# Altium schematic sheet CPU.SchDoc
size A
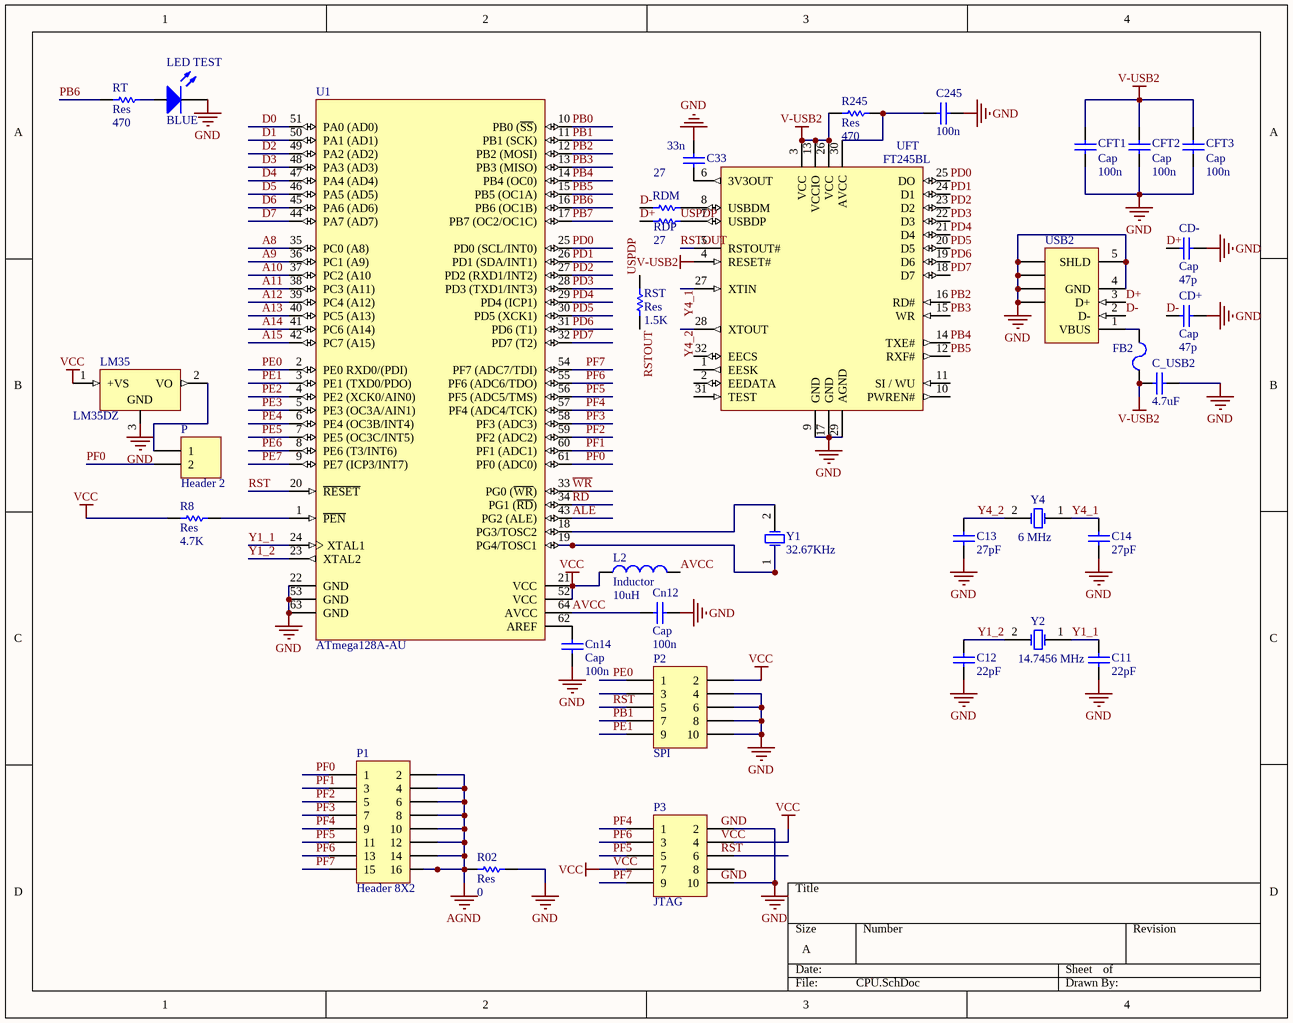
[diagram p0: CPU.SchDoc]

## Parts
C11  value 22pF  [1608[0603]]  (hidden comment: Cap_UP)
C12  value 22pF  [1608[0603]]  (hidden comment: Cap_UP)
C13  value 27pF  [1608[0603]]  (hidden comment: Cap_UP)
C14  value 27pF  [1608[0603]]  (hidden comment: Cap_UP)
C33  value 33n  [1608[0603]]  (hidden comment: Cap_UP)
C245  value 100n  [1608[0603]]  (hidden comment: Cap_UP)
C_USB2  value 4.7uF  [2012[0805]]  (hidden comment: Cap_UP)
CD+  Cap  value 47p  [1608[0603]]
CD-  Cap  value 47p  [1608[0603]]
CFT1  Cap  value 100n  [1608[0603]]
CFT2  Cap  value 100n  [1608[0603]]
CFT3  Cap  value 100n  [1608[0603]]
Cn12  Cap  value 100n  [1608[0603]]
Cn14  Cap  value 100n  [1608[0603]]
FB2  (no value)  [2012[0805]]
L2  Inductor  value 10uH  [2012[0805]]
LED_TEST  BLUE  [3518]
LM35  LM35DZ  [Z03A]
P  Header 2  [HDR1X2]
P1  Header 8X2  [HDR2X8]
P2  SPI  [HDR2X5]
P3  JTAG  [HDR2X5]
R02  Res  value 0  [1608[0603]]
R8  Res  value 4.7K  [1608[0603]]
R245  Res  value 470  [1608[0603]]
RDM  value 27  [1608[0603]]  (hidden comment: Res)
RDP  value 27  [1608[0603]]  (hidden comment: es)
RST  Res  value 1.5K  [1608[0603]]
RT  Res  value 470  [1608[0603]]
U1  ATmega128A-AU  [64A_N]
UFT  FT245BL  [LQFP-32_N]
USB2  (no value)  [USB_Mini]
Y1  32.67KHz  [Xtal-smd]
Y2  14.7456 MHz  [Xtal-smd]
Y4  6 MHz  [Xtal-smd]

## Nets
AGND: P1.2 P1.4 P1.6 P1.8 P1.10 P1.12 P1.14 P1.16 R02.2
GND: C11.2 C12.2 C13.2 C14.2 C33.2 C245.2 C_USB2.2 CD+.1 CD-.1 CFT1.1 CFT2.1 CFT3.1 Cn12.1 Cn14.2 LED_TEST.2(K) P2.4 P2.6 P2.8 P2.10 P3.2 P3.10 R02.1 U1.22(GND) U1.53(GND) U1.63(GND) UFT.9(GND) UFT.17(GND) UFT.29(AGND) USB2.4(GND) USB2.5(SHLD) USB2.6(SHLD) USB2.7(SHLD) USB2.8(SHLD) USB2.9(SHLD)
V-USB2: C_USB2.1 CFT1.2 CFT2.2 CFT3.2 FB2.2 R245.1 UFT.3(VCC) UFT.4(RESET#) UFT.13(VCCIO) UFT.26(VCC)
VCC: L2.1 LM35.1(+VS) P2.2 P3.4 P3.7 R8.1 U1.21(VCC) U1.52(VCC)
A8: U1.35(PC0_(A8))
A9: U1.36(PC1_(A9))
A10: U1.37(PC2_(A10)
A11: U1.38(PC3_(A11))
A12: U1.39(PC4_(A12))
A13: U1.40(PC5_(A13))
A14: U1.41(PC6_(A14))
A15: U1.42(PC7_(A15))
ALE: U1.43(PG2_(ALE))
AVCC: Cn12.2 L2.2 U1.64(AVCC)
D0: U1.51(PA0_(AD0))
D1: U1.50(PA1_(AD1))
D2: U1.49(PA2_(AD2))
D3: U1.48(PA3_(AD3))
D4: U1.47(PA4_(AD4))
D5: U1.46(PA5_(AD5))
D6: U1.45(PA6_(AD6))
D7: U1.44(PA7_(AD7))
D+: CD-.2 RDP.1 USB2.3(D+)
D-: CD+.2 RDM.1 USB2.2(D-)
PB0: U1.10(PB0_(~{SS}))
PB1: P2.7 U1.11(PB1_(SCK))
PB2: U1.12(PB2_(MOSI)) UFT.16(RD#)
PB3: U1.13(PB3_(MISO)) UFT.15(WR)
PB4: U1.14(PB4_(OC0)) UFT.14(TXE#)
PB5: U1.15(PB5_(OC1A)) UFT.12(RXF#)
PB6: RT.2 U1.16(PB6_(OC1B))
PB7: U1.17(PB7_(OC2/OC1C))
PD0: U1.25(PD0_(SCL/INT0)) UFT.25(DO)
PD1: U1.26(PD1_(SDA/INT1)) UFT.24(D1)
PD2: U1.27(PD2_(RXD1/INT2)) UFT.23(D2)
PD3: U1.28(PD3_(TXD1/INT3)) UFT.22(D3)
PD4: U1.29(PD4_(ICP1)) UFT.21(D4)
PD5: U1.30(PD5_(XCK1)) UFT.20(D5)
PD6: U1.31(PD6_(T1)) UFT.19(D6)
PD7: U1.32(PD7_(T2)) UFT.18(D7)
PE0: P2.1 U1.2(PE0_RXD0/(PDI))
PE1: P2.9 U1.3(PE1_(TXD0/PDO))
PE2: U1.4(PE2_(XCK0/AIN0))
PE3: U1.5(PE3_(OC3A/AIN1))
PE4: U1.6(PE4_(OC3B/INT4))
PE5: U1.7(PE5_(OC3C/INT5))
PE6: U1.8(PE6_(T3/INT6))
PE7: U1.9(PE7_(ICP3/INT7))
PF0: P.2 P1.1 U1.61(PF0_(ADC0))
PF1: P1.3 U1.60(PF1_(ADC1))
PF2: P1.5 U1.59(PF2_(ADC2))
PF3: P1.7 U1.58(PF3_(ADC3))
PF4: P1.9 P3.1 U1.57(PF4_(ADC4/TCK))
PF5: P1.11 P3.5 U1.56(PF5_(ADC5/TMS))
PF6: P1.13 P3.3 U1.55(PF6_(ADC6/TDO))
PF7: P1.15 P3.9 U1.54(PF7_(ADC7/TDI))
~{RD}: U1.34(PG1_(~{RD}))
RST: P2.5 U1.20(~{RESET})
RSTOUT: RST.1 UFT.5(RSTOUT#)
USPDP: RST.2
~{WR}: U1.33(PG0_(~{WR}))
Y1_1: C11.1 U1.24(XTAL1) Y2.1(OSC1)
Y1_2: C12.1 U1.23(XTAL2) Y2.2(OSC2)
Y4_1: C14.1 UFT.27(XTIN) Y4.1(OSC1)
Y4_2: C13.1 UFT.28(XTOUT) Y4.2(OSC2)
NetC33_1: C33.1 UFT.6(3V3OUT)
NetC245_1: C245.1 R245.2 UFT.30(AVCC)
NetCn14_1: Cn14.1 U1.62(AREF)
NetFB2_1: FB2.1 USB2.1(VBUS)
NetLED_TEST_1: LED_TEST.1(A) RT.1
NetLM35_2: LM35.2(VO) P.1
NetR8_2: R8.2 U1.1(~{PEN})
NetRDM_2: RDM.2 UFT.8(USBDM)
NetRDP_2: RDP.2 UFT.7(USBDP)
NetU1_18: U1.18(PG3/TOSC2) Y1.2(OSC2)
NetU1_19: U1.19(PG4/TOSC1) Y1.1(OSC1)

Not connected (* = marked no-connect by the designer): LM35 3(GND); P2 3; P3 6 8; UFT 1(EESK) 2(EEDATA) 10(PWREN#) 11(SI_/_WU) 31(TEST) 32(EECS)

## Notes on the sheet
- Labels drawn without touching a wire or pin: GND, RST, USPDP, VCC

## Library data of the parts
C11-C14 C33 C245 C_USB2 = Cap_UP: Capacitor; Published: 8-Jun-2000; LatestRevisionDate: 17-Jul-2002; LatestRevisionNote: Re-released for DXP Platform.; PackageReference: RAD-0.3; Publisher: Altium Limited
CD+ CD- CFT1-CFT3 Cn12 Cn14 = Cap: Capacitor; Published: 8-Jun-2000; LatestRevisionDate: 17-Jul-2002; LatestRevisionNote: Re-released for DXP Platform.; PackageReference: RAD-0.3; Publisher: Altium Limited; PackageDescription: Radial Cap, Thru-Hole; 2 Leads; 0.3 in Pin Spacing
FB2 = Ferrite Beed: Code_IEC: 1005; Published: 8-Jun-2000; LatestRevisionDate: 17-Jul-2002; LatestRevisionNote: Re-released for DXP Platform.; PackageReference: 0402-A; Publisher: Altium Limited; Code_JEITA: 0402
L2 = Inductor: Code_IEC: 1005; Published: 8-Jun-2000; LatestRevisionDate: 29-May-2009; LatestRevisionNote: IPC-7351 Footprint Added.; PackageReference: 0402-A; Publisher: Altium Limited; PackageDescription: Chip Inductor; Code_JEITA: 0402
LED_TEST = LED3: Typical BLUE SiC LED; Published: 8-Jun-2000; LatestRevisionDate: 17-Dec-2003; LatestRevisionNote: PCB Footprint replaced.; DatasheetVersion: 16-Apr-2002; PackageVersion: 16-Apr-2002; PackageReference: 3.5X2.8X1.9; Publisher: Altium Limited; PackageDescription: SM LED; 2 C-Bend Leads; Body 3.5 x 2.8 x 1.9 mm, inc leads (LxWxH typ)
LM35 = LM35DZ: Precision Centigrade Temperature Sensor, 3-pin TO-92; Manufacturer: National Semiconductor; PackageTopMarking: NSXYTT*LM35*DZ; PowerWise: N; CompType: Temp Sensor IC; High-Reliability: Y; DatasheetVersion: Nov-2000; PackageVersion: revG, Sep-2000; PackageReference: Z03A; PackageDescription: TO-92, Molded, 3 Lead; PartNumber: LM35DZ; RoHS: N; PinCount: 3; Code_JEDEC: TO-226-AA; ComponentLink1Description: Manufacturer URL; ComponentLink1URL: http://www.national.com/; ComponentLink2Description: LM35 Datasheet; ComponentLink2URL: http://www.national.com/ds/LM/LM35.pdf; ComponentLink3Description: LM35 Web Page; ComponentLink3URL: http://www.national.com/pf/LM/LM35.html; ComponentLink4Description: Z03A Package Page; ComponentLink4URL: http://www.national.com/packaging/folders/z03a.html
P = Header 2: Header, 2-Pin; LatestRevisionDate: 17-Jul-2002; LatestRevisionNote: Re-released for DXP Platform.; Publisher: Altium Limited
P1 = Header 8X2: Header, 8-Pin, Dual row; LatestRevisionDate: 17-Jul-2002; LatestRevisionNote: Re-released for DXP Platform.; Publisher: Altium Limited
P2 P3 = Header 5X2: Header, 5-Pin, Dual row; LatestRevisionDate: 17-Jul-2002; LatestRevisionNote: Re-released for DXP Platform.; Publisher: Altium Limited
R02 R8 R245 RDM RDP RST RT = Res: Semiconductor Resistor; Published: 8-Jun-2000; LatestRevisionDate: 17-Jul-2002; LatestRevisionNote: Re-released for DXP Platform.; PackageReference: AXIAL-0.5; Publisher: Altium Limited
U1 = ATmega128A-AU: 8-bit AVR Microcontroller, 2.7-5.5V, 16MHz, 128KB Flash, 4KB EEPROM, 4KB SRAM, 64-pin TQFP, Industrial Grade (-40°C to 85°C); DatasheetVersion: revH, Feb-2011; PackageVersion: revC, Oct-2010; PackageReference: 64A; PackageDescription: 64-Pin Plastic Thin Profile Quad Flat Pack, 14 x 14 x 1.0 mm Body, 0.8 mm Pitch (TQFP); Code_JEDEC: MS-026-AEB; ComponentLink1Description: Manufacturer URL; ComponentLink1URL: http://www.atmel.com/; ComponentLink2Description: ATmega128A Datasheet; ComponentLink2URL: http://www.atmel.com/dyn/resources/prod_documents/doc8151.pdf; ComponentLink3Description: ATmega128A Summary; ComponentLink3URL: http://www.atmel.com/dyn/resources/prod_documents/8151S.pdf
UFT = FT245BL: USB/Parallel FIFO Bi-Directional Data Transfer Chip, LQFP-32, Pb-Free; Published: 6-Jun-2005; LatestRevisionDate: 13-Apr-2006; LatestRevisionNote: IPC-7351 Footprint Added.; DatasheetVersion: ver 1.7, Dec-2005; PackageVersion: 2004; PackageReference: LQFP-32; Publisher: Altium Limited; PackageDescription: 32-Pin Thin Quad Flat Pack 0.8 mm Pitch; ComponentLink1Description: Manufacturer Link; ComponentLink1URL: http://www.ftdichip.com/Products/ICs/FT245B.htm; ComponentLink2Description: Datasheet; ComponentLink2URL: http://www.ftdichip.com/Support/Documents/DataSheets/ICs/DS_FT245BL.pdf
USB2 = 440479-1: USB 2.0, Right Angle, SMT, AB Type, Receptacle, 5 Position, Black; ContactMaterial: Phosphor Bronze; ContactPlating: Gold (30) over Nickel; PCB_Layout: Complies with manufacturer's recommendation.; DrillSize: Corresponds to nominal value.; PanelGround: Without; Published: 15-Jul-2004; DatasheetDocument: 28-Jan-2003; PackageDocument: 28-Jan-2003; PackageReference: 440479; Publisher: Altium Limited; HousingMaterial: Thermoplastic; ComponentLink1Description: Manufacturer Link; ComponentLink1URL: http://www.tycoelectronics.com/; ComponentLink2Description: Packaging Specification; ComponentLink2URL: http://ecommas.tycoelectronics.com/commerce/DocumentDelivery/DDEController?Action=showdoc&DocId=Customer+Drawing%7F440479%7FD%7Fpdf%7FEnglish%7FC_440479_D.pdf
Y1 Y2 Y4 = XTAL: Crystal Oscillator; Published: 8-Jun-2000; LatestRevisionDate: 17-Jul-2002; LatestRevisionNote: Re-released for DXP Platform.; PackageReference: R38; Publisher: Altium Limited